# Altium schematic sheet ddr3_if.SchDoc: DDR3 Interface and Memory
size B; Engineer: Michael J. Kelly; Organization: CSB540otn - Outernet; Address1: AM335x Compute Board; Address2: (C) 2015; Address3: See us on the Web:; Address4: http://outernet.is; DocumentNumber: 2; Revision: V1.0; SheetNumber: 2; SheetTotal: 9
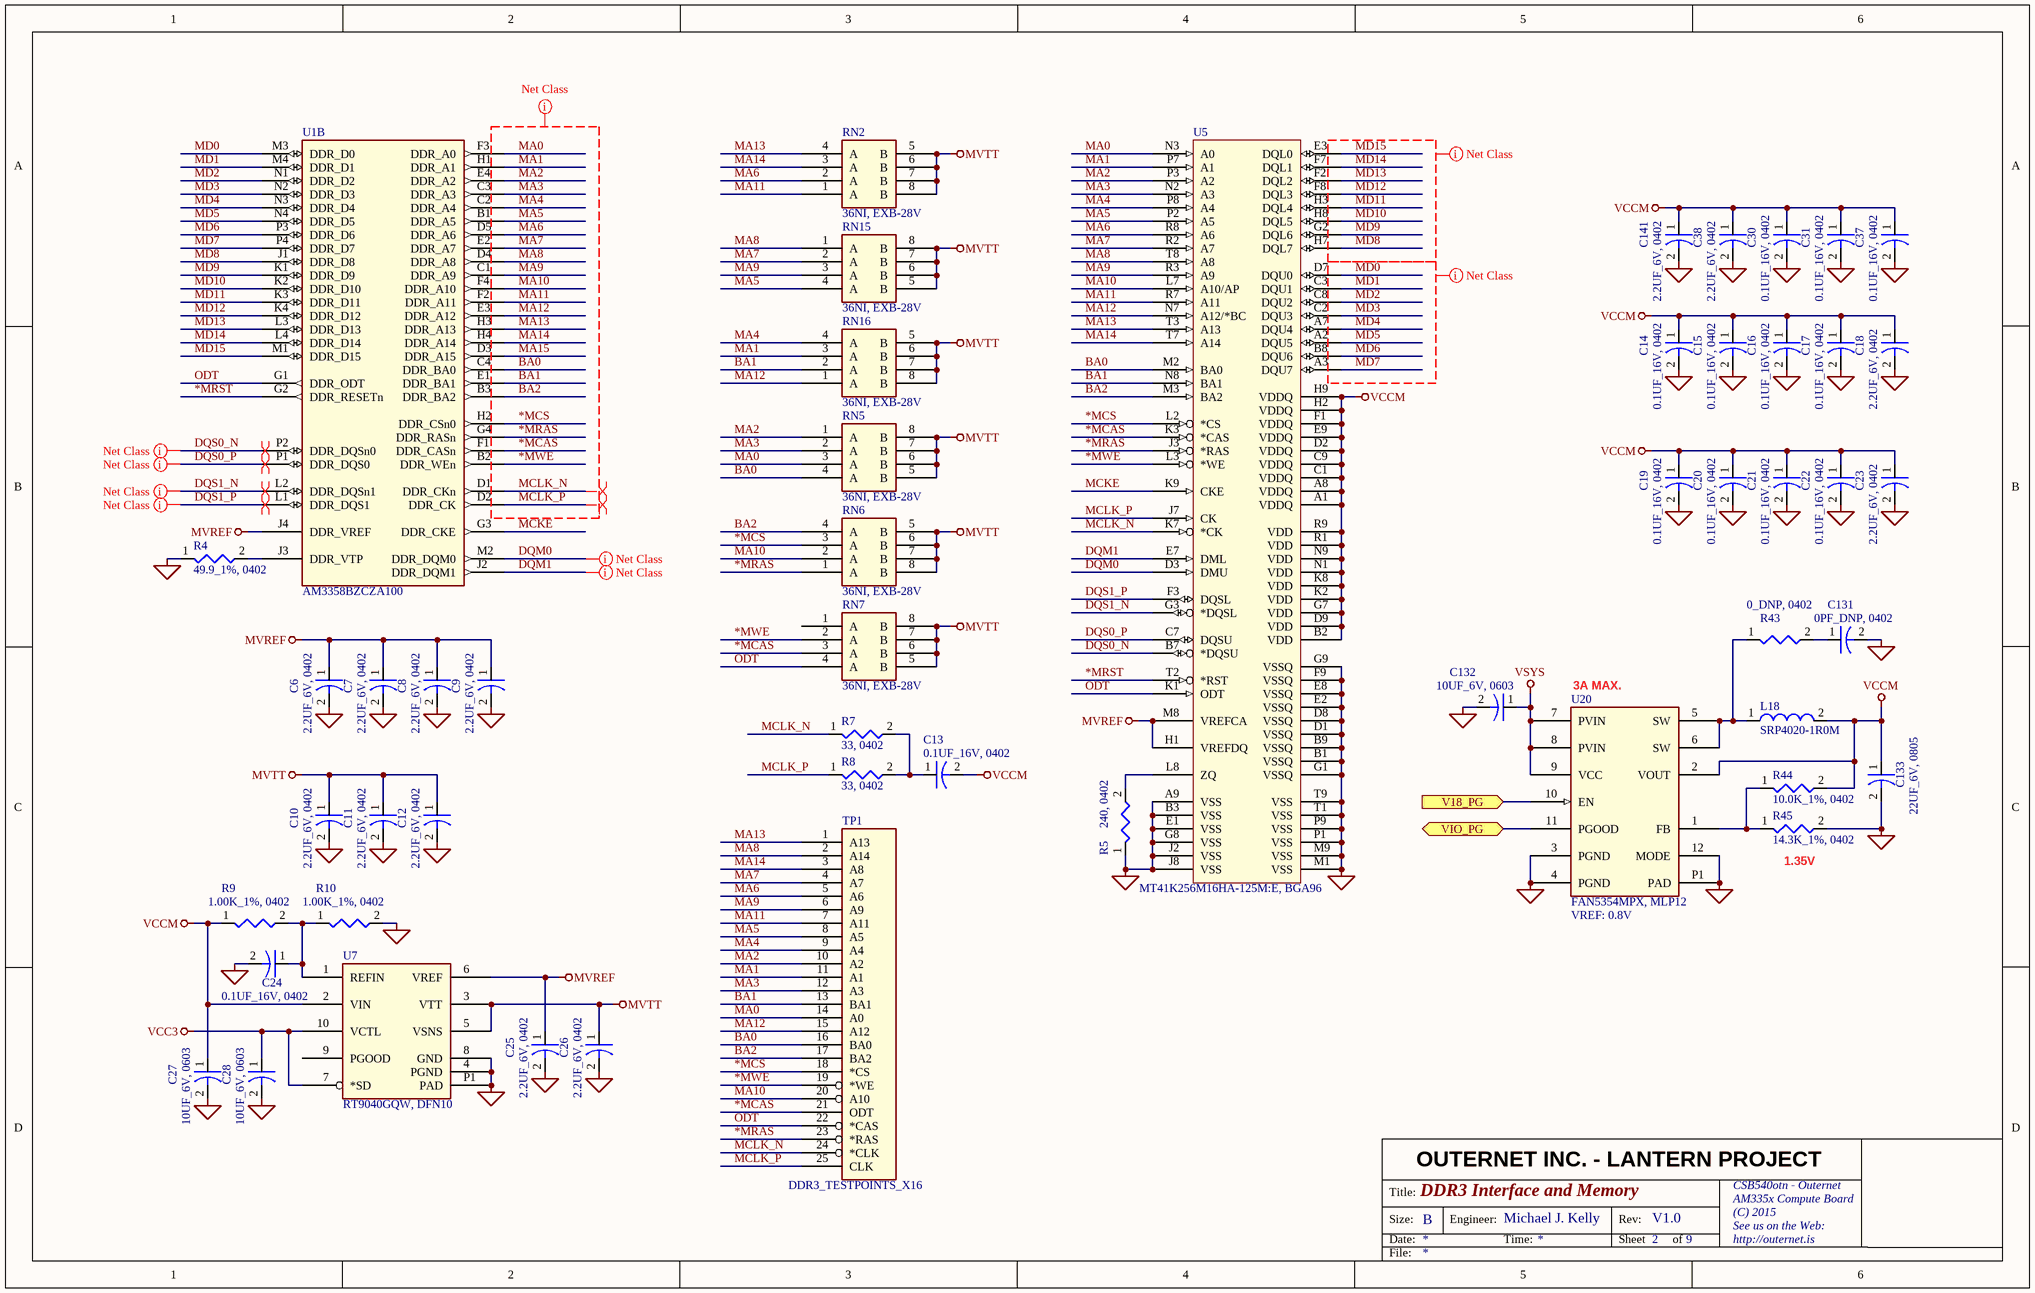
[diagram p0: ddr3_if.SchDoc]

## Parts
C6  2.2UF_6V, 0402  [0402C]
C7  2.2UF_6V, 0402  [0402C]
C8  2.2UF_6V, 0402  [0402C]
C9  2.2UF_6V, 0402  [0402C]
C10  2.2UF_6V, 0402  [0402C]
C11  2.2UF_6V, 0402  [0402C]
C12  2.2UF_6V, 0402  [0402C]
C13  0.1UF_16V, 0402  [0402C]
C14  0.1UF_16V, 0402  [0402C]
C15  0.1UF_16V, 0402  [0402C]
C16  0.1UF_16V, 0402  [0402C]
C17  0.1UF_16V, 0402  [0402C]
C18  2.2UF_6V, 0402  [0402C]
C19  0.1UF_16V, 0402  [0402C]
C20  0.1UF_16V, 0402  [0402C]
C21  0.1UF_16V, 0402  [0402C]
C22  0.1UF_16V, 0402  [0402C]
C23  2.2UF_6V, 0402  [0402C]
C24  0.1UF_16V, 0402  [0402C]
C25  2.2UF_6V, 0402  [0402C]
C26  2.2UF_6V, 0402  [0402C]
C27  10UF_6V, 0603  [0603C]
C28  10UF_6V, 0603  [0603C]
C30  0.1UF_16V, 0402  [0402C]
C31  0.1UF_16V, 0402  [0402C]
C37  0.1UF_16V, 0402  [0402C]
C38  2.2UF_6V, 0402  [0402C]
C131  0PF_DNP, 0402  [0402C]
C132  10UF_6V, 0603  [0603C]
C133  22UF_6V, 0805  [0805C]
C141  2.2UF_6V, 0402  [0402C]
L18  SRP4020-1R0M  [SRP4020]
R4  49.9_1%, 0402  [0402R]
R5  240, 0402  [0402R]
R7  33, 0402  [0402R]
R8  33, 0402  [0402R]
R9  1.00K_1%, 0402  [0402R]
R10  1.00K_1%, 0402  [0402R]
R43  0_DNP, 0402  [0402R]
R44  10.0K_1%, 0402  [0402R]
R45  14.3K_1%, 0402  [0402R]
RN2  36NI, EXB-28V  [EXB-28V]
RN5  36NI, EXB-28V  [EXB-28V]
RN6  36NI, EXB-28V  [EXB-28V]
RN7  36NI, EXB-28V  [EXB-28V]
RN15  36NI, EXB-28V  [EXB-28V]
RN16  36NI, EXB-28V  [EXB-28V]
TP1  DDR3_TESTPOINTS_X16  [DDR2-TP]
U1  AM3358BZCZA100  [BGA324x18]  (part B of 4)
U5  MT41K256M16HA-125M:E, BGA96  [BGA96_DDR3_X16]
U7  RT9040GQW, DFN10  [DFN10]
U20  FAN5354MPX, MLP12  VREF: 0.8V  [mlp12]

## Ports
V18_PG (in), VIO_PG (bidir)

## Nets
GND: C6.2 C7.2 C8.2 C9.2 C10.2 C11.2 C12.2 C14.2 C15.2 C16.2 C17.2 C18.2 C19.2 C20.2 C21.2 C22.2 C23.2 C24.2 C25.2 C26.2 C27.2 C28.2 C30.2 C31.2 C37.2 C38.2 C131.2 C132.2 C133.2 C141.2 R4.1 R5.1 R10.2 R45.2 U5.A9(VSS) U5.B1(VSSQ) U5.B3(VSS) U5.B9(VSSQ) U5.D1(VSSQ) U5.D8(VSSQ) U5.E1(VSS) U5.E2(VSSQ) U5.E8(VSSQ) U5.F9(VSSQ) U5.G1(VSSQ) U5.G8(VSS) U5.G9(VSSQ) U5.J2(VSS) U5.J8(VSS) U5.M1(VSS) U5.M9(VSS) U5.P1(VSS) U5.P9(VSS) U5.T1(VSS) U5.T9(VSS) U7.4(PGND) U7.8(GND) U7.P1(PAD) U20.3(PGND) U20.4(PGND) U20.12(MODE) U20.P1(PAD)
MVREF: C6.1 C7.1 C8.1 C9.1 C25.1 U1.J4(DDR_VREF) U5.H1(VREFDQ) U5.M8(VREFCA) U7.6(VREF)
MVTT: C10.1 C11.1 C12.1 C26.1 RN2.5(B) RN2.6(B) RN2.7(B) RN2.8(B) RN5.5(B) RN5.6(B) RN5.7(B) RN5.8(B) RN6.5(B) RN6.6(B) RN6.7(B) RN6.8(B) RN7.5(B) RN7.6(B) RN7.7(B) RN7.8(B) RN15.5(B) RN15.6(B) RN15.7(B) RN15.8(B) RN16.5(B) RN16.6(B) RN16.7(B) RN16.8(B) U7.3(VTT) U7.5(VSNS)
VCC3: C28.1 U7.7(*SD) U7.10(VCTL)
VCCM: C13.2 C14.1 C15.1 C16.1 C17.1 C18.1 C19.1 C20.1 C21.1 C22.1 C23.1 C27.1 C30.1 C31.1 C37.1 C38.1 C133.1 C141.1 L18.2 R9.1 R44.2 U5.A1(VDDQ) U5.A8(VDDQ) U5.B2(VDD) U5.C1(VDDQ) U5.C9(VDDQ) U5.D2(VDDQ) U5.D9(VDD) U5.E9(VDDQ) U5.F1(VDDQ) U5.G7(VDD) U5.H2(VDDQ) U5.H9(VDDQ) U5.K2(VDD) U5.K8(VDD) U5.N1(VDD) U5.N9(VDD) U5.R1(VDD) U5.R9(VDD) U7.2(VIN) U20.2(VOUT)
VSYS: C132.1 U20.7(PVIN) U20.8(PVIN) U20.9(VCC)
*MCAS: RN7.3(A) TP1.21(ODT) U1.F1(DDR_CASn) U5.K3(*CAS)
*MCS: RN6.3(A) TP1.18(*CS) U1.H2(DDR_CSn0) U5.L2(*CS)
*MRAS: RN6.1(A) TP1.23(*RAS) U1.G4(DDR_RASn) U5.J3(*RAS)
*MRST: U1.G2(DDR_RESETn) U5.T2(*RST)
*MWE: RN7.2(A) TP1.19(*WE) U1.B2(DDR_WEn) U5.L3(*WE)
BA0: RN5.4(A) TP1.16(BA0) U1.C4(DDR_BA0) U5.M2(BA0)
BA1: RN16.2(A) TP1.13(BA1) U1.E1(DDR_BA1) U5.N8(BA1)
BA2: RN6.4(A) TP1.17(BA2) U1.B3(DDR_BA2) U5.M3(BA2)
DQM0: U1.M2(DDR_DQM0) U5.D3(DMU)
DQM1: U1.J2(DDR_DQM1) U5.E7(DML)
DQS0_N: U1.P2(DDR_DQSn0) U5.B7(*DQSU)
DQS0_P: U1.P1(DDR_DQS0) U5.C7(DQSU)
DQS1_N: U1.L2(DDR_DQSn1) U5.G3(*DQSL)
DQS1_P: U1.L1(DDR_DQS1) U5.F3(DQSL)
MA0: RN5.3(A) TP1.14(A0) U1.F3(DDR_A0) U5.N3(A0)
MA1: RN16.3(A) TP1.11(A1) U1.H1(DDR_A1) U5.P7(A1)
MA2: RN5.1(A) TP1.10(A2) U1.E4(DDR_A2) U5.P3(A2)
MA3: RN5.2(A) TP1.12(A3) U1.C3(DDR_A3) U5.N2(A3)
MA4: RN16.4(A) TP1.9(A4) U1.C2(DDR_A4) U5.P8(A4)
MA5: RN15.4(A) TP1.8(A5) U1.B1(DDR_A5) U5.P2(A5)
MA6: RN2.2(A) TP1.5(A6) U1.D5(DDR_A6) U5.R8(A6)
MA7: RN15.2(A) TP1.4(A7) U1.E2(DDR_A7) U5.R2(A7)
MA8: RN15.1(A) TP1.2(A14) U1.D4(DDR_A8) U5.T8(A8)
MA9: RN15.3(A) TP1.6(A9) U1.C1(DDR_A9) U5.R3(A9)
MA10: RN6.2(A) TP1.20(A10) U1.F4(DDR_A10) U5.L7(A10/AP)
MA11: RN2.1(A) TP1.7(A11) U1.F2(DDR_A11) U5.R7(A11)
MA12: RN16.1(A) TP1.15(A12) U1.E3(DDR_A12) U5.N7(A12/*BC)
MA13: RN2.4(A) TP1.1(A13) U1.H3(DDR_A13) U5.T3(A13)
MA14: RN2.3(A) TP1.3(A8) U1.H4(DDR_A14) U5.T7(A14)
MA15: U1.D3(DDR_A15)
MCKE: U1.G3(DDR_CKE) U5.K9(CKE)
MCLK_N: R7.1 TP1.24(*CLK) U1.D1(DDR_CKn) U5.K7(*CK)
MCLK_P: R8.1 TP1.25(CLK) U1.D2(DDR_CK) U5.J7(CK)
MD0: U1.M3(DDR_D0) U5.D7(DQU0)
MD1: U1.M4(DDR_D1) U5.C3(DQU1)
MD2: U1.N1(DDR_D2) U5.C8(DQU2)
MD3: U1.N2(DDR_D3) U5.C2(DQU3)
MD4: U1.N3(DDR_D4) U5.A7(DQU4)
MD5: U1.N4(DDR_D5) U5.A2(DQU5)
MD6: U1.P3(DDR_D6) U5.B8(DQU6)
MD7: U1.P4(DDR_D7) U5.A3(DQU7)
MD8: U1.J1(DDR_D8) U5.H7(DQL7)
MD9: U1.K1(DDR_D9) U5.G2(DQL6)
MD10: U1.K2(DDR_D10) U5.H8(DQL5)
MD11: U1.K3(DDR_D11) U5.H3(DQL4)
MD12: U1.K4(DDR_D12) U5.F8(DQL3)
MD13: U1.L3(DDR_D13) U5.F2(DQL2)
MD14: U1.L4(DDR_D14) U5.F7(DQL1)
MD15: U1.M1(DDR_D15) U5.E3(DQL0)
ODT: RN7.4(A) TP1.22(*CAS) U1.G1(DDR_ODT) U5.K1(ODT)
V18_PG: U20.10(EN) ; port V18_PG
VIO_PG: U20.11(PGOOD) ; port VIO_PG
NetC13_1: C13.1 R7.2 R8.2
NetC24_1: C24.1 R9.2 R10.1 U7.1(REFIN)
NetC131_1: C131.1 R43.2
NetL18_1: L18.1 R43.1 U20.5(SW) U20.6(SW)
NetR4_2: R4.2 U1.J3(DDR_VTP)
NetR5_2: R5.2 U5.L8(ZQ)
NetR44_1: R44.1 R45.1 U20.1(FB)

Not connected (* = marked no-connect by the designer): RN7 1(A); U7 9(PGOOD)

## Layout directives
net class MEM_D0: DQM0, DQS0_N, DQS0_P, MD8, MD9, MD10, MD11, MD12, MD13, MD14, MD15
net class MEM_D1: DQM1, DQS1_N, DQS1_P, MD0, MD1, MD2, MD3, MD4, MD5, MD6, MD7
differential pair: DQS0_N, DQS0_P, DQS1_N, DQS1_P, MCLK_N, MCLK_P
net class MEM_ADD: *MCAS, *MCS, *MRAS, *MWE, BA0, BA1, BA2, MA0, MA1, MA2, MA3, MA4, MA5, MA6, MA7, MA8, MA9, MA10, MA11, MA12, MA13, MA14, MA15, MCLK_N, MCLK_P

## Notes on the sheet
- (near U20) 3A MAX.
- (near R45) 1.35V
- OUTERNET INC. - LANTERN PROJECT
- Title:
- Size:
- Date:
- B
- Engineer:
- Time:
- Rev:
- Sheet
- of
- File:

## Library data of the parts
C6-C12 C18 C23 C25 C26 C38 C141 = 2.2UF_6V, 0402: CAP - 0402 PKG
C13-C17 C19-C22 C24 C30 C31 C37 = 0.1UF_16V, 0402: CAP - 0402 PKG
C27 C28 C132 = 10UF_6V, 0603: CAP - 0603 PKG
C131 = 0PF_DNP, 0402: CAP - 0402 PKG
C133 = 22UF_6V, 0805: CAP - 0805 PKG
L18 = SRP4020-1R0M: INDUCTOR - 1.0UH, 5/6A, 4MM x 4MM x 2MM, 22mohm
R4 = 49.9_1%, 0402: RES - 0402 PKG
R5 = 240, 0402: RES - 0402 PKG
R7 R8 = 33, 0402: RES - 0402 PKG
R9 R10 = 1.00K_1%, 0402: RES - 0402 PKG
R43 = 0_DNP, 0402: RES - 0402 PKG, DO NOT POPULATE BY DEFAULT
R44 = 10.0K_1%, 0402: RES - 0402 PKG
R45 = 14.3K_1%, 0402: RES - 0402 PKG
RN2 RN5-RN7 RN15 RN16 = 36NI, EXB-28V: RES NET, 4 INDIVIDUAL, EXB-28V
TP1 = DDR3_TESTPOINTS_X16: MISC - DDR3 ROUTING PATTERN, 16-BIT
U1 = AM3358BZCZA100: MPU - CORTEX-A8 CORE, SDIO, GIGe, USB x2, UART x3, CAN, 2D/3D
U5 = MT41K256M16HA-125M:E, BGA96: SDRAM - 4GBIT, DDR3/L-1600, x16
U7 = RT9040GQW, DFN10: LDO - DDR2/3 VREF AND VTT, 3A
U20 = FAN5354MPX, MLP12: SWITCHER - 270ua Iq, 3A, 2.7V TO 5.5V IN, 0.8V TO VIN OUT